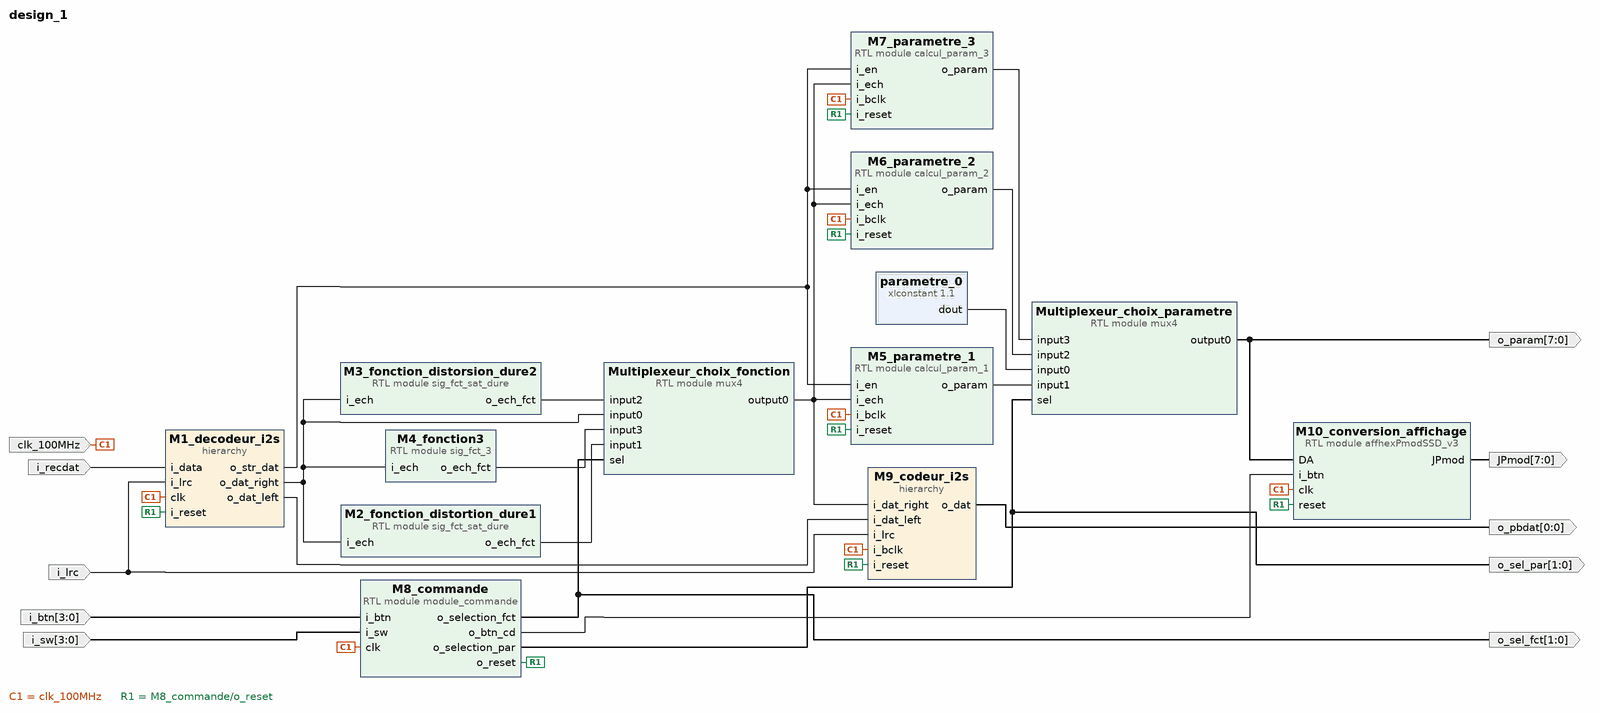
[diagram p0: block diagram of the top level]
# Vivado block design design_1, xc7z010clg400-1, Vivado 2024.1
create_bd_design design_1

create_bd_port -dir I i_recdat
create_bd_port -dir I i_lrc
create_bd_port -dir I -from 3 -to 0 i_btn
create_bd_port -dir I -from 3 -to 0 i_sw
create_bd_port -dir I -type clk clk_100MHz
set_property -dict {CONFIG.FREQ_HZ 100000000} [get_bd_ports clk_100MHz]
create_bd_port -dir O -from 0 -to 0 o_pbdat
create_bd_port -dir O -from 7 -to 0 JPmod
create_bd_port -dir O -from 7 -to 0 o_param
create_bd_port -dir O -from 1 -to 0 o_sel_par
create_bd_port -dir O -from 1 -to 0 o_sel_fct

create_bd_cell -type hier M1_decodeur_i2s
create_bd_cell -type hier M9_codeur_i2s
create_bd_cell -type module -reference affhexPmodSSD_v3 M10_conversion_affichage
create_bd_cell -type module -reference calcul_param_1 M5_parametre_1
create_bd_cell -type module -reference calcul_param_2 M6_parametre_2
create_bd_cell -type module -reference calcul_param_3 M7_parametre_3
create_bd_cell -type module -reference mux4 Multiplexeur_choix_fonction
create_bd_cell -type module -reference mux4 Multiplexeur_choix_parametre
set_property -dict {CONFIG.input_length 8} [get_bd_cells Multiplexeur_choix_parametre]
create_bd_cell -type module -reference sig_fct_3 M4_fonction3
create_bd_cell -type module -reference sig_fct_sat_dure M2_fonction_distortion_dure1
set_property -dict {CONFIG.c_ech_u24_max 0x7FFFFF} [get_bd_cells M2_fonction_distortion_dure1]
create_bd_cell -type module -reference sig_fct_sat_dure M3_fonction_distorsion_dure2
create_bd_cell -type ip -vlnv xilinx.com:ip:xlconstant:1.1 parametre_0
set_property -dict {CONFIG.CONST_VAL 0 CONFIG.CONST_WIDTH 8} [get_bd_cells parametre_0]
create_bd_cell -type module -reference module_commande M8_commande

# ---- hierarchy /M1_decodeur_i2s ----
current_bd_instance /M1_decodeur_i2s
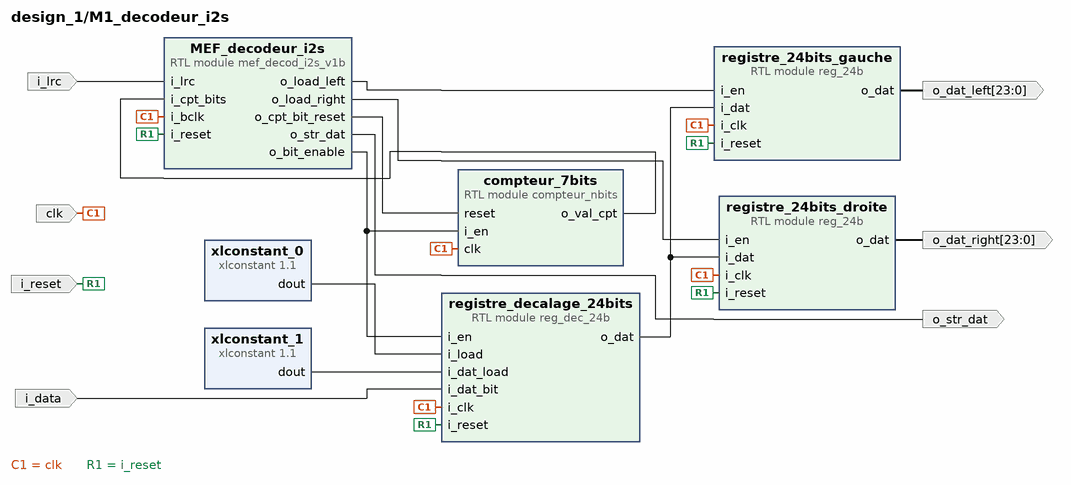
[diagram p1: block diagram inside /M1_decodeur_i2s]
create_bd_pin -dir O o_str_dat
create_bd_pin -dir O -from 23 -to 0 o_dat_left
create_bd_pin -dir O -from 23 -to 0 o_dat_right
create_bd_pin -dir I clk
create_bd_pin -dir I i_data
create_bd_pin -dir I i_lrc
create_bd_pin -dir I i_reset

create_bd_cell -type module -reference compteur_nbits compteur_7bits
set_property -dict {CONFIG.nbits 7} [get_bd_cells compteur_7bits]
create_bd_cell -type module -reference mef_decod_i2s_v1b MEF_decodeur_i2s
create_bd_cell -type module -reference reg_24b registre_24bits_droite
create_bd_cell -type module -reference reg_24b registre_24bits_gauche
create_bd_cell -type module -reference reg_dec_24b registre_decalage_24bits
create_bd_cell -type ip -vlnv xilinx.com:ip:xlconstant:1.1 xlconstant_0
set_property -dict {CONFIG.CONST_VAL 0} [get_bd_cells xlconstant_0]
create_bd_cell -type ip -vlnv xilinx.com:ip:xlconstant:1.1 xlconstant_1
set_property -dict {CONFIG.CONST_WIDTH 24} [get_bd_cells xlconstant_1]

# ---- hierarchy /M9_codeur_i2s ----
current_bd_instance /M9_codeur_i2s
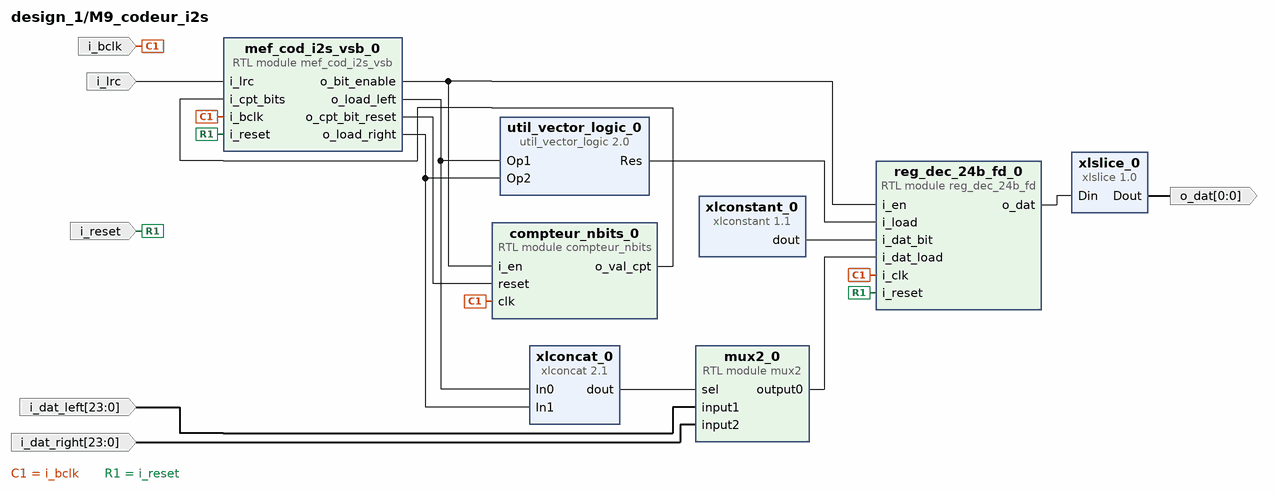
[diagram p2: block diagram inside /M9_codeur_i2s]
create_bd_pin -dir I i_lrc
create_bd_pin -dir I -from 23 -to 0 i_dat_left
create_bd_pin -dir I -from 23 -to 0 i_dat_right
create_bd_pin -dir I -type rst i_reset
create_bd_pin -dir I i_bclk
create_bd_pin -dir O -from 0 -to 0 o_dat

create_bd_cell -type module -reference compteur_nbits compteur_nbits_0
set_property -dict {CONFIG.nbits 7} [get_bd_cells compteur_nbits_0]
create_bd_cell -type module -reference mef_cod_i2s_vsb mef_cod_i2s_vsb_0
create_bd_cell -type module -reference mux2 mux2_0
create_bd_cell -type module -reference reg_dec_24b_fd reg_dec_24b_fd_0
create_bd_cell -type ip -vlnv xilinx.com:ip:util_vector_logic:2.0 util_vector_logic_0
set_property -dict {CONFIG.C_OPERATION or CONFIG.C_SIZE 1} [get_bd_cells util_vector_logic_0]
create_bd_cell -type ip -vlnv xilinx.com:ip:xlconcat:2.1 xlconcat_0
create_bd_cell -type ip -vlnv xilinx.com:ip:xlconstant:1.1 xlconstant_0
create_bd_cell -type ip -vlnv xilinx.com:ip:xlslice:1.0 xlslice_0
set_property -dict {CONFIG.DIN_FROM 23 CONFIG.DIN_TO 23 CONFIG.DIN_WIDTH 24 CONFIG.DOUT_WIDTH 1} [get_bd_cells xlslice_0]

# ---- connections ----

current_bd_instance /M1_decodeur_i2s
connect_bd_net [get_bd_pins clk] \
  [get_bd_pins compteur_7bits/clk] [get_bd_pins registre_24bits_droite/i_clk] [get_bd_pins registre_24bits_gauche/i_clk] \
  [get_bd_pins registre_decalage_24bits/i_clk] [get_bd_pins MEF_decodeur_i2s/i_bclk]
connect_bd_net -net compteur_nbits_0_o_val_cpt [get_bd_pins compteur_7bits/o_val_cpt] [get_bd_pins MEF_decodeur_i2s/i_cpt_bits]
connect_bd_net [get_bd_pins i_data] [get_bd_pins registre_decalage_24bits/i_dat_bit]
connect_bd_net [get_bd_pins i_lrc] [get_bd_pins MEF_decodeur_i2s/i_lrc]
connect_bd_net [get_bd_pins i_reset] \
  [get_bd_pins registre_24bits_droite/i_reset] [get_bd_pins registre_24bits_gauche/i_reset] \
  [get_bd_pins registre_decalage_24bits/i_reset] [get_bd_pins MEF_decodeur_i2s/i_reset]
connect_bd_net -net mef_decod_i2s_v1b_0_o_bit_enable [get_bd_pins MEF_decodeur_i2s/o_bit_enable] \
  [get_bd_pins compteur_7bits/i_en] [get_bd_pins registre_decalage_24bits/i_en]
connect_bd_net -net mef_decod_i2s_v1b_0_o_cpt_bit_reset [get_bd_pins MEF_decodeur_i2s/o_cpt_bit_reset] [get_bd_pins compteur_7bits/reset]
connect_bd_net -net mef_decod_i2s_v1b_0_o_load_left [get_bd_pins MEF_decodeur_i2s/o_load_left] [get_bd_pins registre_24bits_gauche/i_en]
connect_bd_net -net mef_decod_i2s_v1b_0_o_load_right [get_bd_pins MEF_decodeur_i2s/o_load_right] [get_bd_pins registre_24bits_droite/i_en]
connect_bd_net -net mef_decod_i2s_v1b_0_o_str_dat [get_bd_pins MEF_decodeur_i2s/o_str_dat] [get_bd_pins o_str_dat]
connect_bd_net -net reg_24b_0_o_dat [get_bd_pins registre_24bits_droite/o_dat] [get_bd_pins o_dat_right]
connect_bd_net -net reg_24b_1_o_dat [get_bd_pins registre_24bits_gauche/o_dat] [get_bd_pins o_dat_left]
connect_bd_net -net reg_dec_24b_0_o_dat [get_bd_pins registre_decalage_24bits/o_dat] \
  [get_bd_pins registre_24bits_droite/i_dat] [get_bd_pins registre_24bits_gauche/i_dat]
connect_bd_net [get_bd_pins xlconstant_0/dout] [get_bd_pins registre_decalage_24bits/i_load]
connect_bd_net [get_bd_pins xlconstant_1/dout] [get_bd_pins registre_decalage_24bits/i_dat_load]

current_bd_instance /M9_codeur_i2s
connect_bd_net [get_bd_pins compteur_nbits_0/o_val_cpt] [get_bd_pins mef_cod_i2s_vsb_0/i_cpt_bits]
connect_bd_net -net i_bclk_0_1 [get_bd_pins i_bclk] \
  [get_bd_pins mef_cod_i2s_vsb_0/i_bclk] [get_bd_pins reg_dec_24b_fd_0/i_clk] [get_bd_pins compteur_nbits_0/clk]
connect_bd_net -net i_lrc_0_1 [get_bd_pins i_lrc] [get_bd_pins mef_cod_i2s_vsb_0/i_lrc]
connect_bd_net -net i_reset_0_1 [get_bd_pins i_reset] [get_bd_pins mef_cod_i2s_vsb_0/i_reset] [get_bd_pins reg_dec_24b_fd_0/i_reset]
connect_bd_net -net input1_0_1 [get_bd_pins i_dat_left] [get_bd_pins mux2_0/input1]
connect_bd_net -net input2_0_1 [get_bd_pins i_dat_right] [get_bd_pins mux2_0/input2]
connect_bd_net [get_bd_pins mef_cod_i2s_vsb_0/o_bit_enable] [get_bd_pins reg_dec_24b_fd_0/i_en] [get_bd_pins compteur_nbits_0/i_en]
connect_bd_net [get_bd_pins mef_cod_i2s_vsb_0/o_cpt_bit_reset] [get_bd_pins compteur_nbits_0/reset]
connect_bd_net [get_bd_pins mef_cod_i2s_vsb_0/o_load_left] [get_bd_pins util_vector_logic_0/Op1] [get_bd_pins xlconcat_0/In0]
connect_bd_net [get_bd_pins mef_cod_i2s_vsb_0/o_load_right] [get_bd_pins util_vector_logic_0/Op2] [get_bd_pins xlconcat_0/In1]
connect_bd_net [get_bd_pins mux2_0/output0] [get_bd_pins reg_dec_24b_fd_0/i_dat_load]
connect_bd_net [get_bd_pins reg_dec_24b_fd_0/o_dat] [get_bd_pins xlslice_0/Din]
connect_bd_net [get_bd_pins util_vector_logic_0/Res] [get_bd_pins reg_dec_24b_fd_0/i_load]
connect_bd_net [get_bd_pins xlconcat_0/dout] [get_bd_pins mux2_0/sel]
connect_bd_net [get_bd_pins xlconstant_0/dout] [get_bd_pins reg_dec_24b_fd_0/i_dat_bit]
connect_bd_net [get_bd_pins xlslice_0/Dout] [get_bd_pins o_dat]

current_bd_instance /
connect_bd_net [get_bd_pins M10_conversion_affichage/JPmod] [get_bd_ports JPmod]
connect_bd_net [get_bd_pins M8_commande/o_btn_cd] [get_bd_pins M10_conversion_affichage/i_btn]
connect_bd_net [get_bd_pins M8_commande/o_selection_par] [get_bd_ports o_sel_par] [get_bd_pins Multiplexeur_choix_parametre/sel]
connect_bd_net [get_bd_pins M9_codeur_i2s/o_dat] [get_bd_ports o_pbdat]
connect_bd_net -net calcul_param_1_0_o_param [get_bd_pins M5_parametre_1/o_param] [get_bd_pins Multiplexeur_choix_parametre/input1]
connect_bd_net -net calcul_param_2_0_o_param [get_bd_pins M6_parametre_2/o_param] [get_bd_pins Multiplexeur_choix_parametre/input2]
connect_bd_net -net calcul_param_3_0_o_param [get_bd_pins M7_parametre_3/o_param] [get_bd_pins Multiplexeur_choix_parametre/input3]
connect_bd_net -net clk_1 [get_bd_ports clk_100MHz] \
  [get_bd_pins M1_decodeur_i2s/clk] [get_bd_pins M9_codeur_i2s/i_bclk] [get_bd_pins M10_conversion_affichage/clk] \
  [get_bd_pins M7_parametre_3/i_bclk] [get_bd_pins M8_commande/clk] [get_bd_pins M6_parametre_2/i_bclk] \
  [get_bd_pins M5_parametre_1/i_bclk]
connect_bd_net -net decodeur_i2s_o_dat_right [get_bd_pins M1_decodeur_i2s/o_dat_right] \
  [get_bd_pins Multiplexeur_choix_fonction/input0] [get_bd_pins M4_fonction3/i_ech] \
  [get_bd_pins M2_fonction_distortion_dure1/i_ech] [get_bd_pins M3_fonction_distorsion_dure2/i_ech]
connect_bd_net -net decodeur_i2s_o_str_dat [get_bd_pins M1_decodeur_i2s/o_str_dat] \
  [get_bd_pins M7_parametre_3/i_en] [get_bd_pins M6_parametre_2/i_en] [get_bd_pins M5_parametre_1/i_en]
connect_bd_net [get_bd_ports i_btn] [get_bd_pins M8_commande/i_btn]
connect_bd_net -net i_dat_left_1 [get_bd_pins M1_decodeur_i2s/o_dat_left] [get_bd_pins M9_codeur_i2s/i_dat_left]
connect_bd_net -net i_dat_right_1 [get_bd_pins Multiplexeur_choix_fonction/output0] \
  [get_bd_pins M9_codeur_i2s/i_dat_right] [get_bd_pins M7_parametre_3/i_ech] [get_bd_pins M6_parametre_2/i_ech] \
  [get_bd_pins M5_parametre_1/i_ech]
connect_bd_net -net i_data_1 [get_bd_ports i_recdat] [get_bd_pins M1_decodeur_i2s/i_data]
connect_bd_net [get_bd_ports i_lrc] [get_bd_pins M1_decodeur_i2s/i_lrc] [get_bd_pins M9_codeur_i2s/i_lrc]
connect_bd_net -net i_reset_1 [get_bd_pins M8_commande/o_reset] \
  [get_bd_pins M1_decodeur_i2s/i_reset] [get_bd_pins M9_codeur_i2s/i_reset] [get_bd_pins M10_conversion_affichage/reset] \
  [get_bd_pins M7_parametre_3/i_reset] [get_bd_pins M6_parametre_2/i_reset] [get_bd_pins M5_parametre_1/i_reset]
connect_bd_net [get_bd_ports i_sw] [get_bd_pins M8_commande/i_sw]
connect_bd_net -net module_commande_0_o_selection_fct [get_bd_pins M8_commande/o_selection_fct] \
  [get_bd_ports o_sel_fct] [get_bd_pins Multiplexeur_choix_fonction/sel]
connect_bd_net -net mux4_1_output [get_bd_pins Multiplexeur_choix_parametre/output0] [get_bd_ports o_param] [get_bd_pins M10_conversion_affichage/DA]
connect_bd_net -net sig_fct_3_0_o_ech_fct [get_bd_pins M4_fonction3/o_ech_fct] [get_bd_pins Multiplexeur_choix_fonction/input3]
connect_bd_net -net sig_fct_sat_dure_0_o_ech_fct [get_bd_pins M2_fonction_distortion_dure1/o_ech_fct] [get_bd_pins Multiplexeur_choix_fonction/input1]
connect_bd_net -net sig_fct_sat_dure_1_o_ech_fct [get_bd_pins M3_fonction_distorsion_dure2/o_ech_fct] [get_bd_pins Multiplexeur_choix_fonction/input2]
connect_bd_net -net xlconstant_0_dout [get_bd_pins parametre_0/dout] [get_bd_pins Multiplexeur_choix_parametre/input0]

set_property USER_COMMENTS.comment_1 {Modules à modifier:
MEF_decodeur_i2s (dans M1_decodeur_i2s)
M5_parametre_1
M6_parametre_2
M8_commande
Pour plus de clarté, vous pouvez cacher les fils pour les horloges
et les resets dans les paramètres (engrenage en haut a droite de cette fenêtre).
} [current_bd_design]

validate_bd_design
save_bd_design
